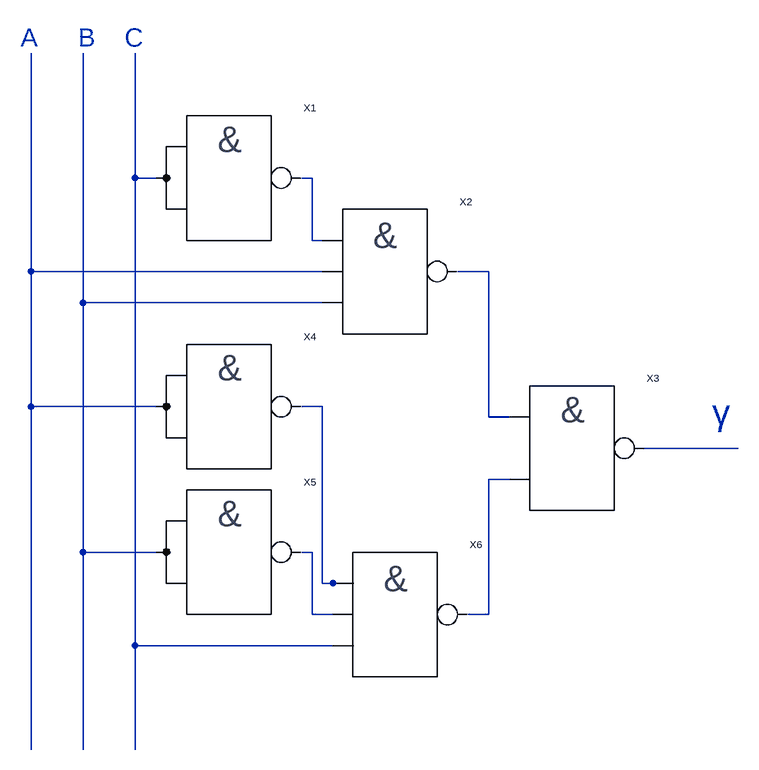
[diagram p0: schematic PER.asc]
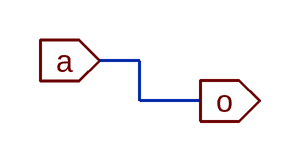
[diagram p1: sub-circuit nand1.asc]
PER.asc, the LTspice schematic file:
Version 4
SHEET 1 1572 1124
WIRE -48 144 -48 -48
WIRE -16 144 -48 144
WIRE 224 144 208 144
WIRE 224 240 224 144
WIRE 240 240 224 240
WIRE -208 288 -208 -48
WIRE 240 288 -208 288
WIRE 496 288 448 288
WIRE -128 336 -128 -48
WIRE 240 336 -128 336
WIRE -208 496 -208 288
WIRE -16 496 -208 496
WIRE 240 496 208 496
WIRE 496 512 496 288
WIRE 528 512 496 512
WIRE 880 560 736 560
WIRE 528 608 496 608
WIRE -128 720 -128 336
WIRE -16 720 -128 720
WIRE 224 720 208 720
WIRE 240 768 240 496
WIRE 256 768 240 768
WIRE 272 768 256 768
WIRE 224 816 224 720
WIRE 256 816 224 816
WIRE 496 816 496 608
WIRE 496 816 464 816
WIRE -48 864 -48 144
WIRE 256 864 -48 864
WIRE -208 1024 -208 496
WIRE -128 1024 -128 720
WIRE -48 1024 -48 864
SYMBOL NAND1 96 144 R0
SYMATTR InstName X1
SYMBOL NAND3 336 288 R0
SYMATTR InstName X2
SYMBOL NAND2 624 560 R0
SYMATTR InstName X3
SYMBOL NAND1 96 496 R0
SYMATTR InstName X4
SYMBOL NAND1 96 720 R0
SYMATTR InstName X5
SYMBOL NAND3 352 816 R0
SYMATTR InstName X6
TEXT -224 -72 Left 4 ;A
TEXT -136 -72 Left 4 ;B
TEXT -64 -72 Left 4 ;C
TEXT 840 504 Left 5 ;γ

nand1.asc, the sub-circuit schematic file:
Version 4
SHEET 1 880 680
WIRE 96 80 64 80
WIRE 96 112 96 80
WIRE 144 112 96 112
FLAG 64 80 a
IOPIN 64 80 In
FLAG 144 112 o
IOPIN 144 112 Out

The netlist it stands for:
* PER.asc
XX1 N001 N002 nand1
XX2 N002 N005 N004 N003 NAND3  ; pins a b o c
XX3 N004 N008 N007 NAND2  ; pins a b o
XX4 N003 N006 nand1
XX5 N005 N009 nand1
XX6 N006 N001 N008 N009 NAND3  ; pins a b o c

* block symbol definitions
.subckt nand1 a o
.ends nand1

* A
* B
* C
* γ
.backanno
.end